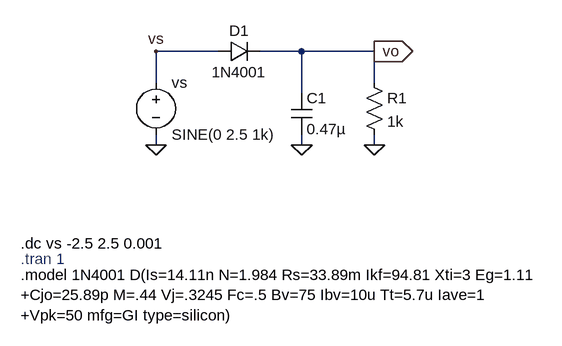
[diagram p0: schematic Lab6p2.asc]
Lab6p2.asc, the LTspice schematic file:
Version 4
SHEET 1 920 680
WIRE 304 16 208 16
WIRE 432 16 368 16
WIRE 544 16 432 16
WIRE 208 64 208 16
WIRE 544 64 544 16
WIRE 432 80 432 16
WIRE 208 160 208 144
WIRE 432 160 432 144
WIRE 544 160 544 144
FLAG 544 160 0
FLAG 208 160 0
FLAG 544 16 vo
IOPIN 544 16 Out
FLAG 208 16 vs
FLAG 432 160 0
SYMBOL diode 304 32 R270
WINDOW 0 32 32 VTop 2
WINDOW 3 0 32 VBottom 2
SYMATTR InstName D1
SYMATTR Value 1N4001
SYMBOL voltage 208 48 R0
WINDOW 123 0 0 Left 0
WINDOW 39 0 0 Left 0
SYMATTR InstName vs
SYMATTR Value SINE(0 2.5 1k)
SYMBOL res 528 48 R0
SYMATTR InstName R1
SYMATTR Value 1k
SYMBOL cap 416 80 R0
SYMATTR InstName C1
SYMATTR Value 0.47µ
TEXT 0 360 Left 2 !.model 1N4001 D(Is=14.11n N=1.984 Rs=33.89m Ikf=94.81 Xti=3 Eg=1.11\n+Cjo=25.89p M=.44 Vj=.3245 Fc=.5 Bv=75 Ibv=10u Tt=5.7u Iave=1\n+Vpk=50 mfg=GI type=silicon)
TEXT 0 336 Left 2 ;.tran 1
TEXT 0 312 Left 2 !.dc vs -2.5 2.5 0.001

The netlist it stands for:
* Lab6p2.asc
D1 vs vo 1N4001
vs vs 0 SINE(0 2.5 1k)
R1 vo 0 1k
C1 vo 0 0.47µ
.model D D
.lib standard.dio
.model 1N4001 D(Is=14.11n N=1.984 Rs=33.89m Ikf=94.81 Xti=3 Eg=1.11
+Cjo=25.89p M=.44 Vj=.3245 Fc=.5 Bv=75 Ibv=10u Tt=5.7u Iave=1
+Vpk=50 mfg=GI type=silicon)
* .tran 1
.dc vs -2.5 2.5 0.001
.backanno
.end